# Altium schematic sheet 60进制计数器.SchDoc
size A4
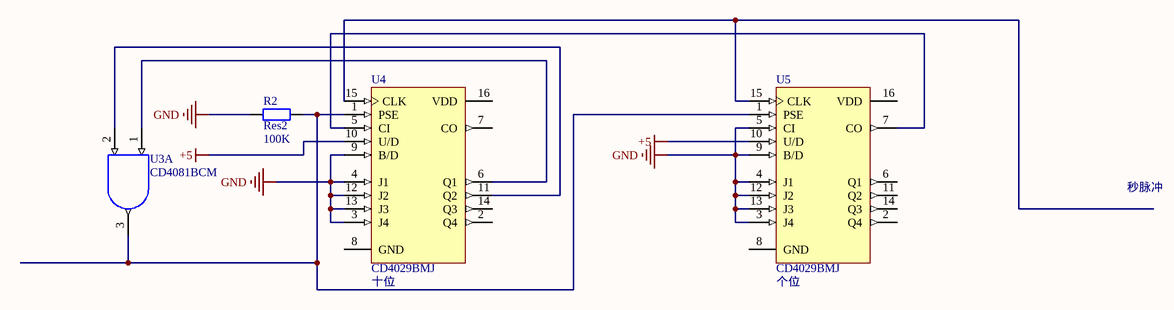
[diagram p0: 60进制计数器.SchDoc]

## Parts
R2  Res2  value 100K  [AXIAL-0.4]
U3  CD4081BCM  [M14A_N]  (part A of 4)
U4  CD4029BMJ  [J16A]
U5  CD4029BMJ  [J16A]

## Nets
+5: U4.10(U/D) U5.10(U/D)
GND: R2.1 U3.7(GND) U4.3(J4) U4.4(J1) U4.9(B/D) U4.12(J2) U4.13(J3) U5.3(J4) U5.4(J1) U5.5(CI) U5.9(B/D) U5.12(J2) U5.13(J3)
VDD: U3.14(VDD)
NetR2_2: R2.2 U3.3(J) U4.1(PSE) U5.1(PSE)
NetU3_1: U3.1(A) U4.6(Q1)
NetU3_2: U3.2(B) U4.11(Q2)
NetU4_5: U4.5(CI) U5.7(CO)
NetU4_15: U4.15(CLK) U5.15(CLK)

Not connected (* = marked no-connect by the designer): U4 2(Q4) 7(CO) 8(GND) 14(Q3) 16(VDD); U5 2(Q4) 6(Q1) 8(GND) 11(Q2) 14(Q3) 16(VDD)

## Notes on the sheet
- 秒脉冲
- (near U4) 十位
- (near U5) 个位

## Library data of the parts
R2 = Res2: Resistor; Published: 8-Jun-2000; LatestRevisionDate: 17-Jul-2002; LatestRevisionNote: Re-released for DXP Platform.; PackageReference: AXIAL-0.4; Publisher: Altium Limited; PackageDescription: Axial Device, Thru-Hole; 2 Leads; 0.4 in Pin Spacing
U3 = CD4081BCM: Quad 2-Input AND Buffered B series Gate, 14-Pin SOIC; IC_Technology: C; Published: 17-Jul-2002; LatestRevisionDate: 13-Apr-2006; LatestRevisionNote: IPC-7351 Footprint Added.; DatasheetVersion: Jan-1999; PackageVersion: 2000; PackageReference: M14A; Publisher: Altium Limited; PackageDescription: 14-Pin Small Outline Integrated Circuit 1.27 mm Pitch; Code_IPC: SOIC127P600-14; ComponentLink1Description: Manufacturer Link; ComponentLink1URL: http://www.fairchildsemi.com/; ComponentLink2Description: Datasheet; ComponentLink2URL: http://www.fairchildsemi.com/ds/CD%2FCD4071BC.pdf
U4 U5 = CD4029BMJ: Binary/Decade Up/Down Counter; Published: 15-Apr-2002; LatestRevisionDate: 06-Jun-2005; LatestRevisionNote: Stylized 3D Model Added.; DatasheetVersion: Jan-1999; PackageVersion: 2000; PackageReference: J16A; Publisher: Altium Limited; PackageDescription: DIP; 16 Leads; Row Spacing 7.62 mm; Pitch 2.54 mm; ComponentLink1Description: Manufacturer Link; ComponentLink1URL: http://www.national.com/; ComponentLink2Description: Datasheet; ComponentLink2URL: http://www.national.com/ds.cgi/CD/CD4029BC.pdf; ComponentLink3Description: URL Link1; ComponentLink3URL: http://www.national.com/pf/CD/CD4029BM.html